# Altium schematic sheet peripherals.SchDoc
size A4; SheetNumber: 7; SheetTotal: 7
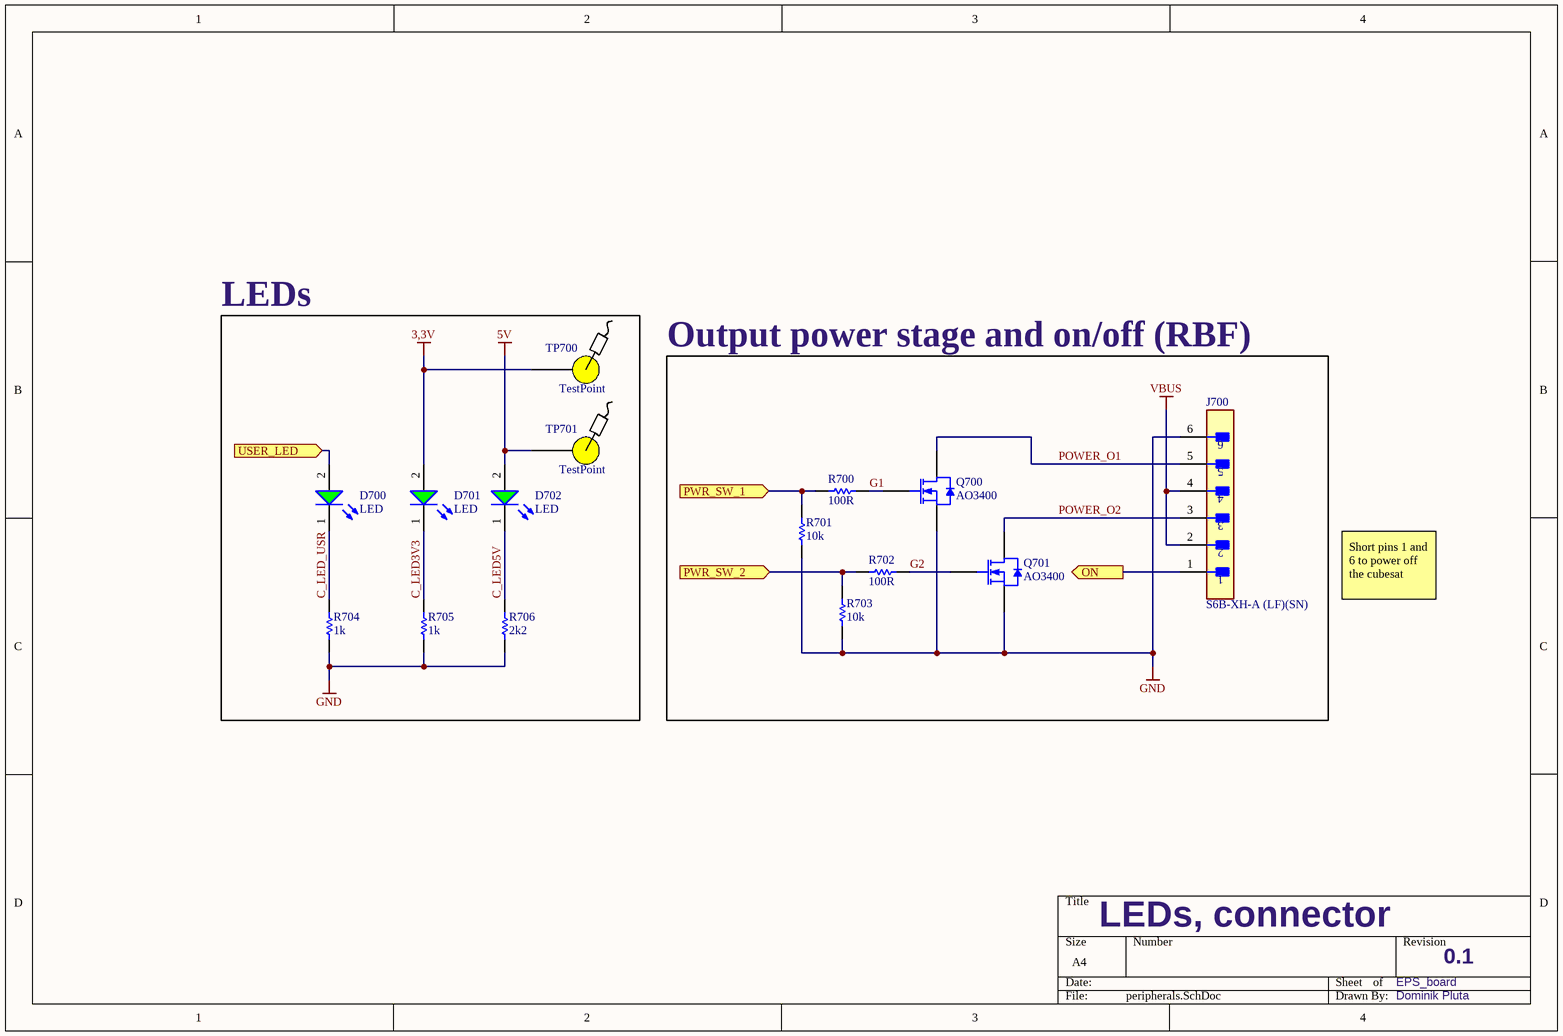
[diagram p0: peripherals.SchDoc]

## Parts
D700  LED  [WL-SMCW_0603_150060xx75000]
D701  LED  [WL-SMCW_0603_150060xx75000]
D702  LED  [WL-SMCW_0603_150060xx75000]
J700  S6B-XH-A (LF)(SN)  [FP-S6B-XH-A_LF_SN-MFG]
Q700  AO3400  [AO-SOT23-3_V]
Q701  AO3400  [AO-SOT23-3_V]
R700  100R  [RESC0603(1608)_N]
R701  10k  [RESC0603(1608)_N]
R702  100R  [RESC0603(1608)_N]
R703  10k  [RESC0603(1608)_N]
R704  1k  [RESC0603(1608)_N]
R705  1k  [RESC0603(1608)_N]
R706  2k2  [RESC0603(1608)_N]
TP700  TestPoint  [Test-point]  (no BOM)
TP701  TestPoint  [Test-point]  (no BOM)

## Blocks framed on the sheet
LEDs: D700-D702 R704-R706 TP700 TP701
Output power stage and on/off (RBF): J700 Q700 Q701 R700-R703

## Ports
ON (out, see EPS[4C]), PWR_SW_1 (in, see EPS[4C], uC[3C]), PWR_SW_2 (in, see EPS[4C], uC[3C]), USER_LED (in, see EPS[4C])

## Nets
3,3V: D701.2(A) TP700.1
5V: D702.2(A) TP701.1
GND: J700.6 Q700.2(S) Q701.2(S) R701.1 R703.1 R704.1 R705.1 R706.1
VBUS: J700.2 J700.4
C_LED3V3: D701.1(K) R705.2
C_LED5V: D702.1(K) R706.2
C_LED_USR: D700.1(K) R704.2
G1: Q700.1(G) R700.1
G2: Q701.1(G) R702.1
ON: J700.1 ; port ON
POWER_O1: J700.5 Q700.3(D)
POWER_O2: J700.3 Q701.3(D)
PWR_SW_1: R700.2 R701.2 ; port PWR_SW_1
PWR_SW_2: R702.2 R703.2 ; port PWR_SW_2
USER_LED: D700.2(A) ; port USER_LED

## Notes on the sheet
- Short pins 1 and 6 to power off the cubesat
- LEDs, connector
- EPS_board
- 0.1
- Dominik Pluta

## Library data of the parts
D700 = CMP-1426-00006-6: Green LED; NexarPartId: 29717778; Reverse Voltage: 5V; Forward Voltage: 2V; Viewing Angle: 140°; Luminous Intensity: 40mcd; Test Current: 20mA; Max Junction Temperature (Tj): 95°C; Wavelength: 570nm; Forward Current: 100mA; Lens Style: Clear, Rectangular; Power Dissipation: 72mW; Peak Wavelength: 572nm; Packaging: Tape and Reel; REACH SVHC: Unknown; Width: 800µm; Max Operating Temperature: 85°C; Number of Pins: 2; RoHS: Compliant; Dominant Wavelength: 570nm; Min Operating Temperature: -40°C; Case Code (Imperial): 0603; Height: 700µm; Length: 1.6mm; Color: Green; Case Code (Metric): 1608; Case/Package: 0603; Max Reverse Voltage (DC): 5V; Mount: Surface Mount
D701 D702 = CMP-1426-00006-6: NexarPartId: 29717778; Reverse Voltage: 5V; Forward Voltage: 2V; Viewing Angle: 140°; Luminous Intensity: 40mcd; Test Current: 20mA; Max Junction Temperature (Tj): 95°C; Wavelength: 570nm; Forward Current: 100mA; Color: Green; Lens Style: Clear, Rectangular; Power Dissipation: 72mW; Peak Wavelength: 572nm; Packaging: Tape and Reel; REACH SVHC: Unknown; Width: 800µm; Max Operating Temperature: 85°C; Number of Pins: 2; RoHS: Compliant; Dominant Wavelength: 570nm; Min Operating Temperature: -40°C; Case Code (Imperial): 0603; Height: 700µm; Length: 1.6mm; Case Code (Metric): 1608; Case/Package: 0603; Max Reverse Voltage (DC): 5V; Mount: Surface Mount
J700 = CMP-17439-000165-2: CONN HEADER R/A 6POS 2.5MM; Number of Contacts: 6; Contact Resistance: 20mR; Max Current Rating: 3A; Max Voltage Rating (AC): 250V; Gender: Male; Insulation Resistance: 1GR; Wire/Cable Gauge: 22AWG; Fastening Type: Detent; Lead Pitch: 2.5mm; Flammability Rating: UL94 V-0; Contact Finish - Mating: TIN; Housing Material: Polyamide; Length: 17.4mm; Termination: Solder; Contact Type: Male Pin; Number of Positions: 6; Mount: Through Hole; Orientation: Right Angle; Voltage Rating (AC): 250V; Contact Shape: Square; Lead Free: Lead Free; Insulation Material: Nylon; Insulation Color: Natural; Contact Plating: Tin; Connector Type: Header; Housing Color: White; Color: Natural; Package Quantity: 500; Contact Material: Brass; Packaging: Bulk; Pitch: 2.5mm; Series: XH; Number of Rows: 1; Min Operating Temperature: -25°C; Voltage Rating: 250V; REACH SVHC: No SVHC; Current Rating: 3A; Depth: 11.5mm; Max Operating Temperature: 85°C
Q700 Q701 = CMP-0278-00001-1: N-channel Enhancement Mode Field-Effect Transistor; 5.8A/30V; Manufacturer: Alpha and Omega; Channel Type: N; Drain-Source Voltage Limit: 30 V; Junction Temperature: -55 to 150 degC; Gate-Source Voltage Limit: +/-12 V; PackageDescription: 3-Pin SOT23, 3.016 x 2.8 mm Body, 0.95 mm Pitch; ComponentLink2Description: Datasheet; DatasheetVersion: Rev.8, 12/2011; ComponentLink3URL: http://www.aosmd.com/res/packaging_information/SOT-23.pdf; Storage Temperature: -55 to 150 degC; ComponentLink3Description: Package Specification; PackageReference: SOT23; ComponentLink1Description: Manufacturer URL; Mounting Technology: Surface Mount; ComponentLink1URL: http://www.aosmd.com/; PartNumber: AO3400; ComponentLink2URL: http://www.aosmd.com/res/data_sheets/AO3400.pdf
R700 R702 = CMP-1012-00081-1: 100R 0.1W 5% 0603 SMD; Case-Metric: 1608; Value: 100.00 Ohm; Case-EIA: 0603; Tolerance: 5 %; Technology: SMT; Power: 0.1 W
R701 R703 = CMP-1012-00081-1: 10k 0.1W 5% 0603 SMD; Case-Metric: 1608; Value: 2000.00 Ohm; Case-EIA: 0603; Tolerance: 5 %; Technology: SMT; Power: 0.1 W
R704 = CMP-1012-00081-1: 1K 0.1W 5% 0603 SMD; Case-Metric: 1608; Value: 1000.00 Ohm; Case-EIA: 0603; Tolerance: 5 %; Technology: SMT; Power: 0.1 W
R705 = CMP-1012-00081-1: 1k 0.1W 5% 0603 (1608 Metric)  SMD; Case-Metric: 1608; Value: 1000.00 Ohm; Case-EIA: 0603; Tolerance: 5 %; Technology: SMT; Power: 0.1 W
R706 = CMP-1012-00081-1: 2k2 0.1W 5% 0603 SMD; Case-Metric: 1608; Value: 2200.00 Ohm; Case-EIA: 0603; Tolerance: 5 %; Technology: SMT; Power: 0.1 W
TP700 TP701 = Test-point: SMD test point